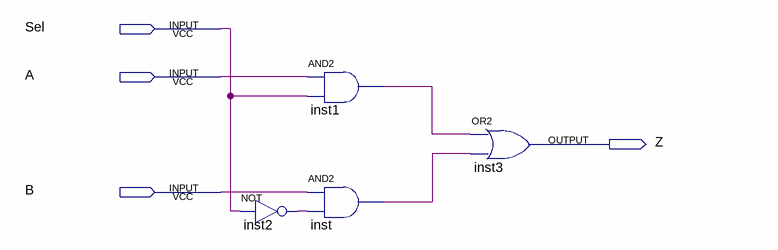
[diagram p0: schematic sheet]
// Quartus schematic Mux2x1.bdf as structural Verilog: 4 symbols, 4 pins
module Mux2x1 (
  input  Sel,
  input  A,
  input  B,
  output Z
);

  wire inst1_out, inst2_out, inst_out;

  not inst2 (inst2_out, Sel);
  and inst1 (inst1_out, A, Sel);
  and inst (inst_out, B, inst2_out);
  or inst3 (Z, inst1_out, inst_out);
endmodule
